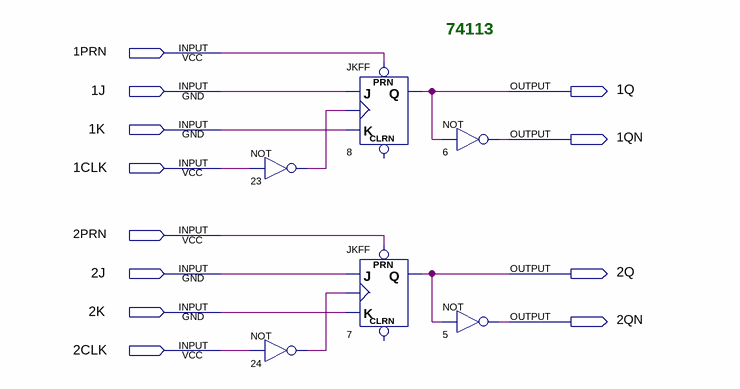
[diagram p0: schematic sheet]
// Quartus schematic 74113.bdf as structural Verilog: 6 symbols, 12 pins
module \74113  (
  input  \1PRN ,
  input  \1J ,
  input  \1K ,
  input  \1CLK ,
  input  \2PRN ,
  input  \2J ,
  input  \2K ,
  input  \2CLK ,
  output \1Q ,
  output \1QN ,
  output \2Q ,
  output \2QN 
);

  wire n23_out, n24_out;

  not u_23 (n23_out, \1CLK );
  not u_24 (n24_out, \2CLK );
  JKFF u_8 (.PRN(\1PRN ), .K(\1K ), .J(\1J ), .CLK(n23_out), .Q(\1Q ));  // open: CLRN
  JKFF u_7 (.PRN(\2PRN ), .K(\2K ), .J(\2J ), .CLK(n24_out), .Q(\2Q ));  // open: CLRN
  not u_6 (\1QN , \1Q );
  not u_5 (\2QN , \2Q );

  // Notes on the sheet:
  //   74113
endmodule
